# EAGLE design PTZ_23brd (EAGLE 6.4)
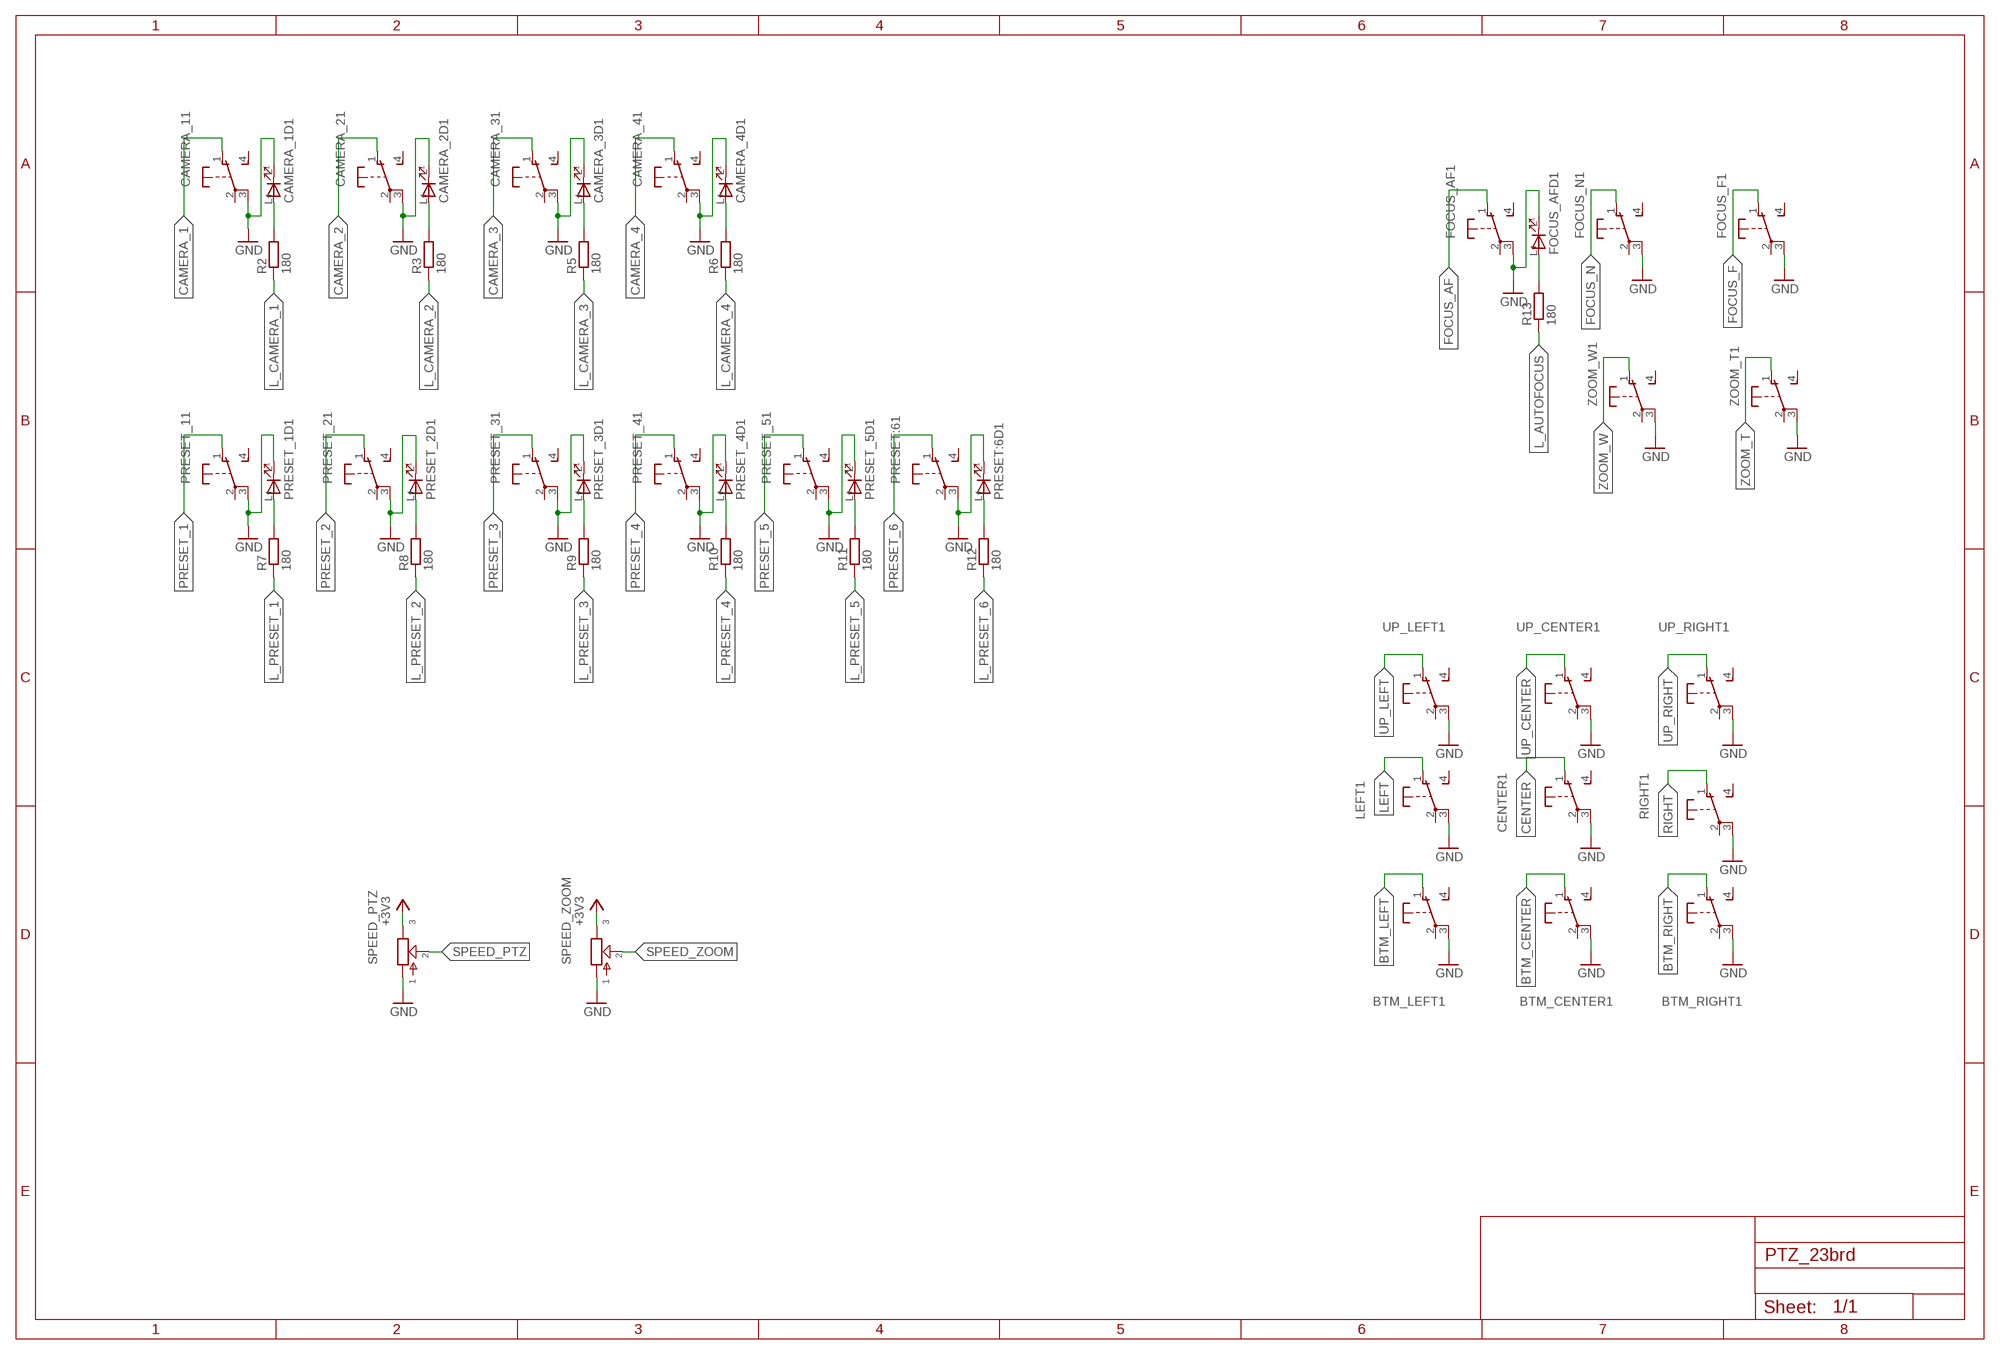
[diagram p0: schematic, sheet 1, part 1 of 2]
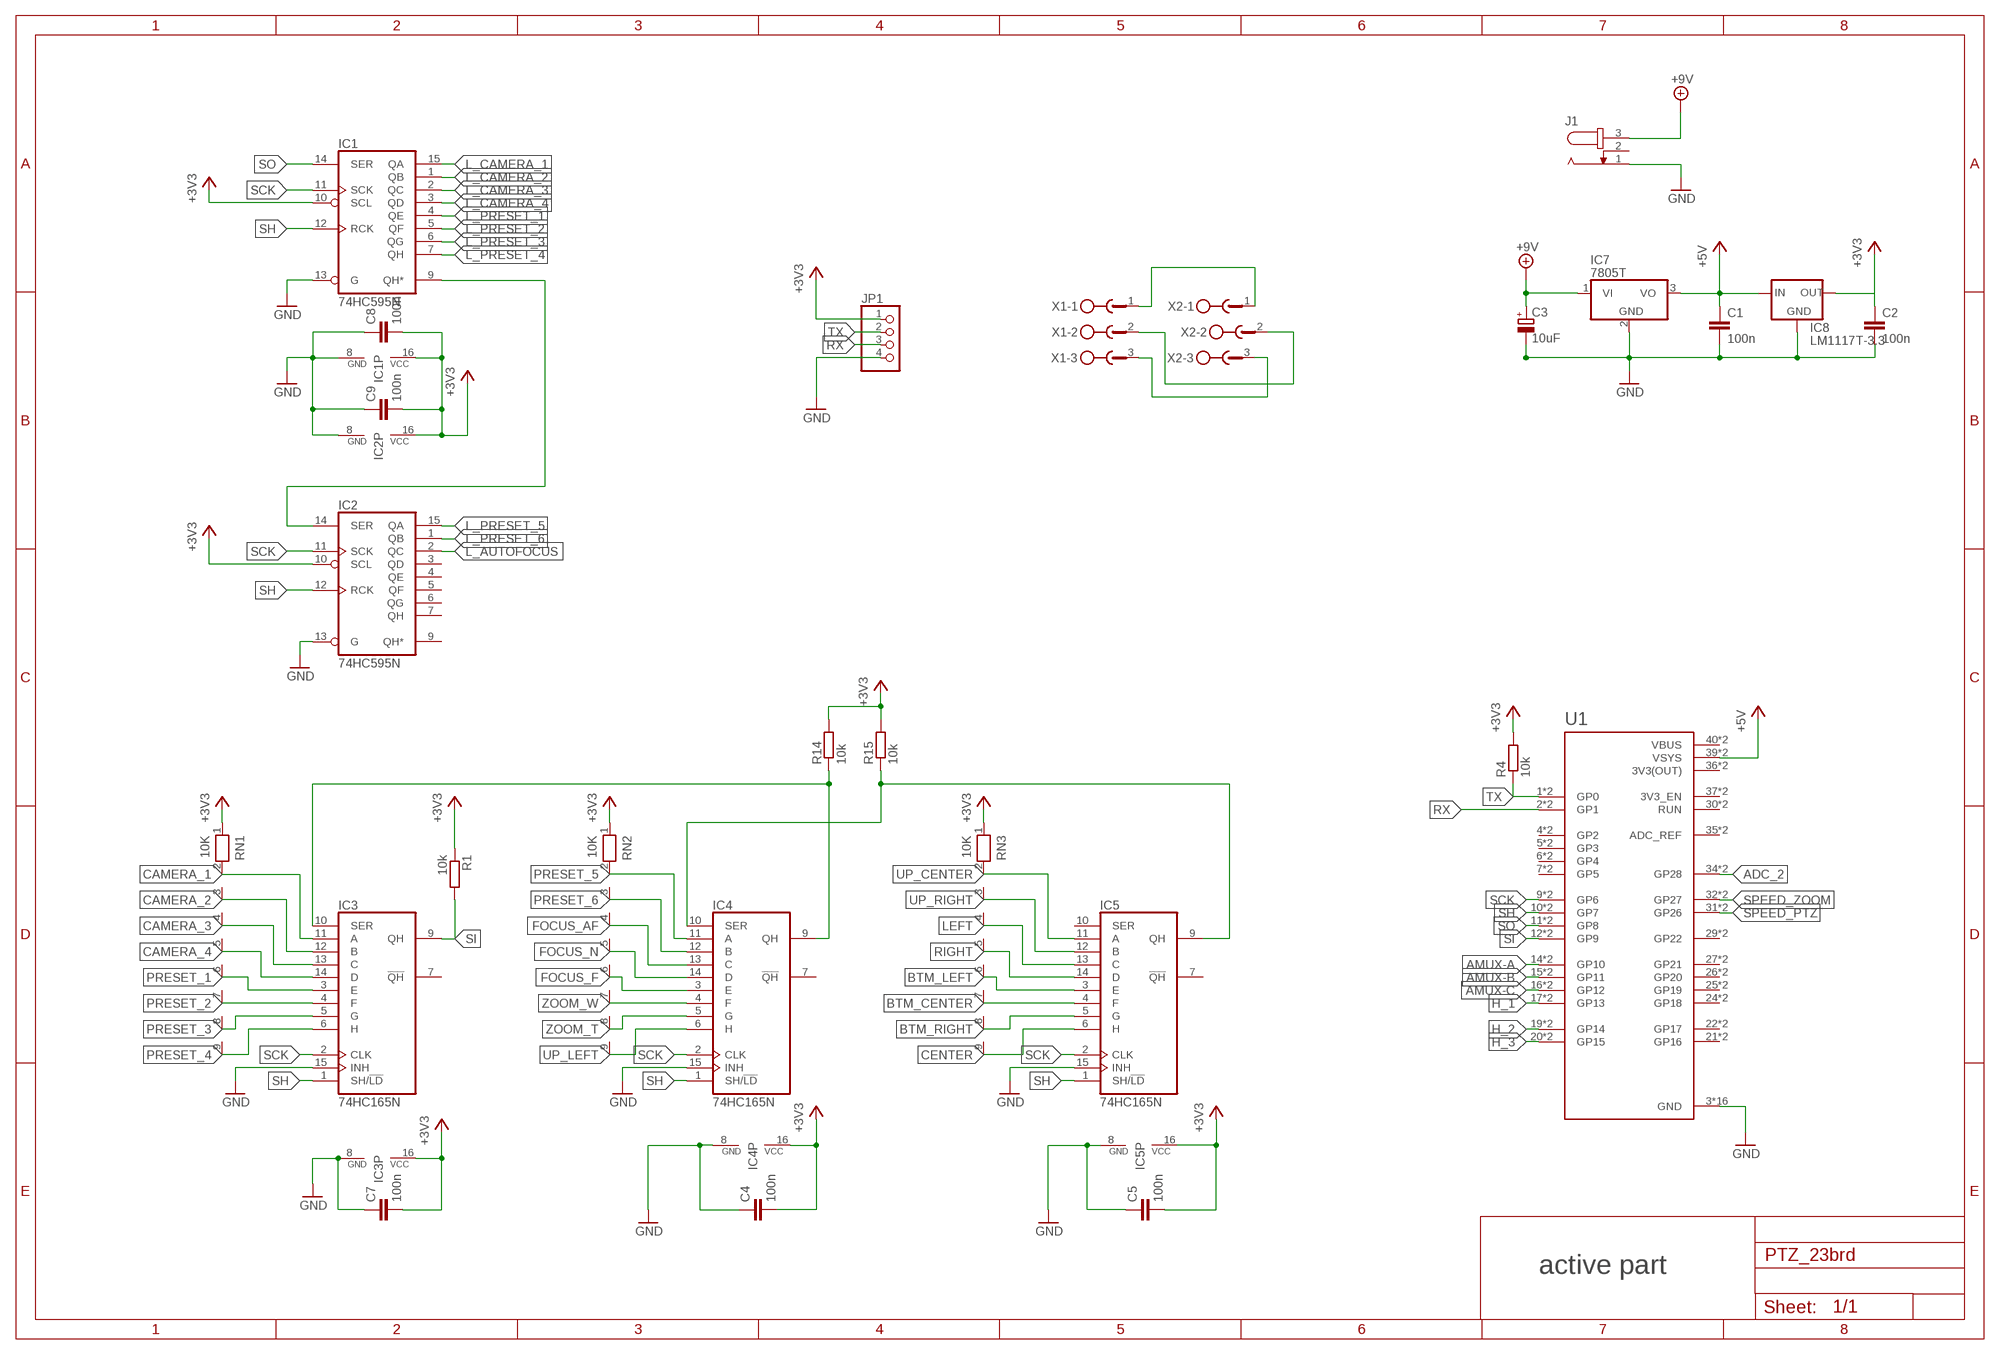
[diagram p1: schematic, sheet 1, part 2 of 2]

## Parts
BTM_CENTER  SWITCH-SHANPU_SRKLSHANPU_SPL  [SWITCH-SHANPU_SPLG1YCS0014]
BTM_LEFT  SWITCH-SHANPU_SRKLSHANPU_SPL  [SWITCH-SHANPU_SPLG1YCS0014]
BTM_RIGHT  SWITCH-SHANPU_SRKLSHANPU_SPL  [SWITCH-SHANPU_SPLG1YCS0014]
C1  100n  C-EU025-025X050  [C025-025X050]
C2  100n  C-EU025-025X050  [C025-025X050]
C3  10uF  CPOL-EUE2-5  [E2-5]
C4  100n  C-EU025-025X050  [C025-025X050]
C5  100n  C-EU025-025X050  [C025-025X050]
C7  100n  C-EU025-025X050  [C025-025X050]
C8  100n  C-EU025-025X050  [C025-025X050]
C9  100n  C-EU025-025X050  [C025-025X050]
CAMERA_1  SWITCH-SHANPU_SRKLSHANPU_SPL  [SWITCH-SHANPU_SPLG1YCS0014]
CAMERA_2  SWITCH-SHANPU_SRKLSHANPU_SPL  [SWITCH-SHANPU_SPLG1YCS0014]
CAMERA_3  SWITCH-SHANPU_SRKLSHANPU_SPL  [SWITCH-SHANPU_SPLG1YCS0014]
CAMERA_4  SWITCH-SHANPU_SRKLSHANPU_SPL  [SWITCH-SHANPU_SPLG1YCS0014]
CENTER  SWITCH-SHANPU_SRKLSHANPU_SPL  [SWITCH-SHANPU_SPLG1YCS0014]
FOCUS_AF  SWITCH-SHANPU_SRKLSHANPU_SPL  [SWITCH-SHANPU_SPLG1YCS0014]
FOCUS_F  SWITCH-SHANPU_SRKLSHANPU_SPL  [SWITCH-SHANPU_SPLG1YCS0014]
FOCUS_N  SWITCH-SHANPU_SRKLSHANPU_SPL  [SWITCH-SHANPU_SPLG1YCS0014]
IC1  74HC595N  [DIL16]
IC2  74HC595N  [DIL16]
IC3  74HC165N  [DIL16]
IC4  74HC165N  [DIL16]
IC5  74HC165N  [DIL16]
IC7  7805T  [TO220H]
IC8  LM1117T-3.3  LM1117_LM1117T-3.3  [LM1117_TO220]
J1  MOJO61_REAR42R_CON-JACK_JACK-PLUG  [MOJO61_REAR42R_CON-JACK_2.1PCB]
JP1  PINHD-1X4  [1X04]
LEFT  SWITCH-SHANPU_SRKLSHANPU_SPL  [SWITCH-SHANPU_SPLG1YCS0014]
PRESET:6  SWITCH-SHANPU_SRKLSHANPU_SPL  [SWITCH-SHANPU_SPLG1YCS0014]
PRESET_1  SWITCH-SHANPU_SRKLSHANPU_SPL  [SWITCH-SHANPU_SPLG1YCS0014]
PRESET_2  SWITCH-SHANPU_SRKLSHANPU_SPL  [SWITCH-SHANPU_SPLG1YCS0014]
PRESET_3  SWITCH-SHANPU_SRKLSHANPU_SPL  [SWITCH-SHANPU_SPLG1YCS0014]
PRESET_4  SWITCH-SHANPU_SRKLSHANPU_SPL  [SWITCH-SHANPU_SPLG1YCS0014]
PRESET_5  SWITCH-SHANPU_SRKLSHANPU_SPL  [SWITCH-SHANPU_SPLG1YCS0014]
R1  10k  R-EU_0207/7  [0207/7]
R2  180  R-EU_0207/7  [0207/7]
R3  180  R-EU_0207/7  [0207/7]
R4  10k  R-EU_0207/7  [0207/7]
R5  180  R-EU_0207/7  [0207/7]
R6  180  R-EU_0207/7  [0207/7]
R7  180  R-EU_0207/7  [0207/7]
R8  180  R-EU_0207/7  [0207/7]
R9  180  R-EU_0207/7  [0207/7]
R10  180  R-EU_0207/7  [0207/7]
R11  180  R-EU_0207/7  [0207/7]
R12  180  R-EU_0207/7  [0207/7]
R13  180  R-EU_0207/7  [0207/7]
R14  10k  R-EU_0207/7  [0207/7]
R15  10k  R-EU_0207/7  [0207/7]
RIGHT  SWITCH-SHANPU_SRKLSHANPU_SPL  [SWITCH-SHANPU_SPLG1YCS0014]
RN1  10K  RN08  [RN-9]
RN2  10K  RN08  [RN-9]
RN3  10K  RN08  [RN-9]
SPEED_PTZ  GM-POTS_POT-EU12MM  [GM-POTS_RV120DF-40B1-(L)K]
SPEED_ZOOM  GM-POTS_POT-EU12MM  [GM-POTS_RV120DF-40B1-(L)K]
U1  RPIPICO_RASPBERRY_PICO-NO_DEBUG  [RPIPICO_PICO-PKG-NO_DEBUG]
UP_CENTER  SWITCH-SHANPU_SRKLSHANPU_SPL  [SWITCH-SHANPU_SPLG1YCS0014]
UP_LEFT  SWITCH-SHANPU_SRKLSHANPU_SPL  [SWITCH-SHANPU_SPLG1YCS0014]
UP_RIGHT  SWITCH-SHANPU_SRKLSHANPU_SPL  [SWITCH-SHANPU_SPLG1YCS0014]
X1  W232-3  [W232-3]
X2  W232-3  [W232-3]
ZOOM_T  SWITCH-SHANPU_SRKLSHANPU_SPL  [SWITCH-SHANPU_SPLG1YCS0014]
ZOOM_W  SWITCH-SHANPU_SRKLSHANPU_SPL  [SWITCH-SHANPU_SPLG1YCS0014]

## Nets
+3V3: C2.1 C4.2 C5.2 C7.2 C8.2 C9.2 IC1.10(SCL) IC1.16(VCC) IC2.10(SCL) IC2.16(VCC) IC3.16(VCC) IC4.16(VCC) IC5.16(VCC) IC8.2(OUT) JP1.1 R1.1 R4.2 R14.2 R15.2 RN1.1 RN2.1 RN3.1 SPEED_PTZ.3 SPEED_ZOOM.3
+5V: C1.1 IC7.3(VO) IC8.3(IN) U1.39(VSYS) U1.P$39(VSYS)
+9V: C3.+ IC7.1(VI) J1.3
ADC_2: U1.34(GP28) U1.P$34(GP28)
AMUX-A: U1.14(GP10) U1.P$14(GP10)
AMUX-B: U1.15(GP11) U1.P$15(GP11)
AMUX-C: U1.16(GP12) U1.P$16(GP12)
BTM_CENTER: BTM_CENTER.1(1:O) IC5.4(F) RN3.7
BTM_LEFT: BTM_LEFT.1(1:O) IC5.3(E) RN3.6
BTM_RIGHT: BTM_RIGHT.1(1:O) IC5.5(G) RN3.8
CAMERA_1: CAMERA_1.1(1:O) IC3.11(A) RN1.2
CAMERA_2: CAMERA_2.1(1:O) IC3.12(B) RN1.3
CAMERA_3: CAMERA_3.1(1:O) IC3.13(C) RN1.4
CAMERA_4: CAMERA_4.1(1:O) IC3.14(D) RN1.5
CENTER: CENTER.1(1:O) IC5.6(H) RN3.9
FOCUS_AF: FOCUS_AF.1(1:O) IC4.13(C) RN2.4
FOCUS_F: FOCUS_F.1(1:O) IC4.3(E) RN2.6
FOCUS_N: FOCUS_N.1(1:O) IC4.14(D) RN2.5
GND: BTM_CENTER.3(1:P) BTM_LEFT.3(1:P) BTM_RIGHT.3(1:P) C1.2 C2.2 C3.- C4.1 C5.1 C7.1 C8.1 C9.1 CAMERA_1.3(1:P) CAMERA_1.L-(D1:C) CAMERA_2.3(1:P) CAMERA_2.L-(D1:C) CAMERA_3.3(1:P) CAMERA_3.L-(D1:C) CAMERA_4.3(1:P) CAMERA_4.L-(D1:C) CENTER.3(1:P) FOCUS_AF.3(1:P) FOCUS_AF.L-(D1:C) FOCUS_F.3(1:P) FOCUS_N.3(1:P) IC1.8(GND) IC1.13(G) IC2.8(GND) IC2.13(G) IC3.8(GND) IC3.15(INH) IC4.8(GND) IC4.15(INH) IC5.8(GND) IC5.15(INH) IC7.2(GND) IC8.1(GND) J1.1 JP1.4 LEFT.3(1:P) PRESET:6.3(1:P) PRESET:6.L-(D1:C) PRESET_1.3(1:P) PRESET_1.L-(D1:C) PRESET_2.3(1:P) PRESET_2.L-(D1:C) PRESET_3.3(1:P) PRESET_3.L-(D1:C) PRESET_4.3(1:P) PRESET_4.L-(D1:C) PRESET_5.3(1:P) PRESET_5.L-(D1:C) RIGHT.3(1:P) SPEED_PTZ.1 SPEED_ZOOM.1 U1.3(GND) U1.8(GND) U1.13(GND) U1.18(GND) U1.23(GND) U1.28(GND) U1.33(GND) U1.38(GND) U1.P$3(GND) U1.P$8(GND) U1.P$13(GND) U1.P$18(GND) U1.P$23(GND) U1.P$28(GND) U1.P$33(GND) U1.P$38(GND) UP_CENTER.3(1:P) UP_LEFT.3(1:P) UP_RIGHT.3(1:P) ZOOM_T.3(1:P) ZOOM_W.3(1:P)
H_1: U1.17(GP13) U1.P$17(GP13)
H_2: U1.19(GP14) U1.P$19(GP14)
H_3: U1.20(GP15) U1.P$20(GP15)
L_AUTOFOCUS: IC2.2(QC) R13.1
L_CAMERA_1: IC1.15(QA) R2.1
L_CAMERA_2: IC1.1(QB) R3.1
L_CAMERA_3: IC1.2(QC) R5.1
L_CAMERA_4: IC1.3(QD) R6.1
L_PRESET_1: IC1.4(QE) R7.1
L_PRESET_2: IC1.5(QF) R8.1
L_PRESET_3: IC1.6(QG) R9.1
L_PRESET_4: IC1.7(QH) R10.1
L_PRESET_5: IC2.15(QA) R11.1
L_PRESET_6: IC2.1(QB) R12.1
LEFT: IC5.13(C) LEFT.1(1:O) RN3.4
N$1: IC1.9(QH*) IC2.14(SER)
N$2: IC3.10(SER) IC4.9(QH) R14.1
N$3: CAMERA_1.L+(D1:A) R2.2
N$4: IC4.10(SER) IC5.9(QH) R15.1
N$5: PRESET_2.L+(D1:A) R8.2
N$6: X1.1 X2.1
N$7: X1.2 X2.2
N$8: X1.3 X2.3
N$11: CAMERA_2.L+(D1:A) R3.2
N$12: CAMERA_3.L+(D1:A) R5.2
N$13: PRESET_3.L+(D1:A) R9.2
N$14: CAMERA_4.L+(D1:A) R6.2
N$17: FOCUS_AF.L+(D1:A) R13.2
N$21: PRESET_4.L+(D1:A) R10.2
N$22: PRESET_1.L+(D1:A) R7.2
N$25: PRESET_5.L+(D1:A) R11.2
N$28: PRESET:6.L+(D1:A) R12.2
PRESET_1: IC3.3(E) PRESET_1.1(1:O) RN1.6
PRESET_2: IC3.4(F) PRESET_2.1(1:O) RN1.7
PRESET_3: IC3.5(G) PRESET_3.1(1:O) RN1.8
PRESET_4: IC3.6(H) PRESET_4.1(1:O) RN1.9
PRESET_5: IC4.11(A) PRESET_5.1(1:O) RN2.2
PRESET_6: IC4.12(B) PRESET:6.1(1:O) RN2.3
RIGHT: IC5.14(D) RIGHT.1(1:O) RN3.5
RX: JP1.3 U1.2(GP1) U1.P$2(GP1)
SCK: IC1.11(SCK) IC2.11(SCK) IC3.2(CLK) IC4.2(CLK) IC5.2(CLK) U1.9(GP6) U1.P$9(GP6)
SH: IC1.12(RCK) IC2.12(RCK) IC3.1(SH/!LD) IC4.1(SH/!LD) IC5.1(SH/!LD) U1.10(GP7) U1.P$10(GP7)
SI: IC3.9(QH) R1.2 U1.12(GP9) U1.P$12(GP9)
SO: IC1.14(SER) U1.11(GP8) U1.P$11(GP8)
SPEED_PTZ: SPEED_PTZ.2 U1.31(GP26) U1.P$31(GP26)
SPEED_ZOOM: SPEED_ZOOM.2 U1.32(GP27) U1.P$32(GP27)
TX: JP1.2 R4.1 U1.1(GP0) U1.P$1(GP0)
UP_CENTER: IC5.11(A) RN3.2 UP_CENTER.1(1:O)
UP_LEFT: IC4.6(H) RN2.9 UP_LEFT.1(1:O)
UP_RIGHT: IC5.12(B) RN3.3 UP_RIGHT.1(1:O)
ZOOM_T: IC4.5(G) RN2.8 ZOOM_T.1(1:O)
ZOOM_W: IC4.4(F) RN2.7 ZOOM_W.1(1:O)
Unconnected: BTM_CENTER.2(1:P) BTM_CENTER.4(1:S) BTM_CENTER.L+(D1:A) BTM_CENTER.L-(D1:C) BTM_LEFT.2(1:P) BTM_LEFT.4(1:S) BTM_LEFT.L+(D1:A) BTM_LEFT.L-(D1:C) BTM_RIGHT.2(1:P) BTM_RIGHT.4(1:S) BTM_RIGHT.L+(D1:A) BTM_RIGHT.L-(D1:C) CAMERA_1.2(1:P) CAMERA_1.4(1:S) CAMERA_2.2(1:P) CAMERA_2.4(1:S) CAMERA_3.2(1:P) CAMERA_3.4(1:S) CAMERA_4.2(1:P) CAMERA_4.4(1:S) CENTER.2(1:P) CENTER.4(1:S) CENTER.L+(D1:A) CENTER.L-(D1:C) FOCUS_AF.2(1:P) FOCUS_AF.4(1:S) FOCUS_F.2(1:P) FOCUS_F.4(1:S) FOCUS_F.L+(D1:A) FOCUS_F.L-(D1:C) FOCUS_N.2(1:P) FOCUS_N.4(1:S) FOCUS_N.L+(D1:A) FOCUS_N.L-(D1:C) IC2.3(QD) IC2.4(QE) IC2.5(QF) IC2.6(QG) IC2.7(QH) IC2.9(QH*) IC3.7(!QH) IC4.7(!QH) IC5.7(!QH) IC5.10(SER) J1.2 LEFT.2(1:P) LEFT.4(1:S) LEFT.L+(D1:A) LEFT.L-(D1:C) PRESET:6.2(1:P) PRESET:6.4(1:S) PRESET_1.2(1:P) PRESET_1.4(1:S) PRESET_2.2(1:P) PRESET_2.4(1:S) PRESET_3.2(1:P) PRESET_3.4(1:S) PRESET_4.2(1:P) PRESET_4.4(1:S) PRESET_5.2(1:P) PRESET_5.4(1:S) RIGHT.2(1:P) RIGHT.4(1:S) RIGHT.L+(D1:A) RIGHT.L-(D1:C) U1.4(GP2) U1.5(GP3) U1.6(GP4) U1.7(GP5) U1.21(GP16) U1.22(GP17) U1.24(GP18) U1.25(GP19) U1.26(GP20) U1.27(GP21) U1.29(GP22) U1.30(RUN) U1.35(ADC_REF) U1.37(3V3_EN) U1.P$4(GP2) U1.P$5(GP3) U1.P$6(GP4) U1.P$7(GP5) U1.P$21(GP16) U1.P$22(GP17) U1.P$24(GP18) U1.P$25(GP19) U1.P$26(GP20) U1.P$27(GP21) U1.P$29(GP22) U1.P$30(RUN) U1.P$35(ADC_REF) U1.P$37(3V3_EN) UP_CENTER.2(1:P) UP_CENTER.4(1:S) UP_CENTER.L+(D1:A) UP_CENTER.L-(D1:C) UP_LEFT.2(1:P) UP_LEFT.4(1:S) UP_LEFT.L+(D1:A) UP_LEFT.L-(D1:C) UP_RIGHT.2(1:P) UP_RIGHT.4(1:S) UP_RIGHT.L+(D1:A) UP_RIGHT.L-(D1:C) ZOOM_T.2(1:P) ZOOM_T.4(1:S) ZOOM_T.L+(D1:A) ZOOM_T.L-(D1:C) ZOOM_W.2(1:P) ZOOM_W.4(1:S) ZOOM_W.L+(D1:A) ZOOM_W.L-(D1:C)

## Notes on the sheet
- active part

## Power pins joined to a net without a drawn wire
3V3(OUT): U1.36(3V3(OUT)) U1.P$36(3V3(OUT))
VBUS: U1.40(VBUS) U1.P$40(VBUS)

## Library data of the parts
BTM_CENTER BTM_LEFT BTM_RIGHT CAMERA_1-CAMERA_4 CENTER FOCUS_AF FOCUS_F FOCUS_N LEFT PRESET:6 PRESET_1-PRESET_5 RIGHT UP_CENTER UP_LEFT UP_RIGHT ZOOM_T ZOOM_W = MOJO_CL_SC_RIGHT_V28:SWITCH-SHANPU_SRKL: SWITCH
C1 C2 C4 C5 C7-C9 = rcl:C-EU: CAPACITOR, European symbol
C3 = rcl:CPOL-EU: POLARIZED CAPACITOR, European symbol
IC1 IC2 = 74xx-eu:74*595: 8-bit SHIFT REGISTER, output latch
IC3-IC5 = 74xx-eu:74*165: 8-bit parallel load SHIFT REGISTER
IC7 = linear:78*: Positive VOLTAGE REGULATOR Source: http://cache.national.com/ds/LM/LM78L05.pdf http://www.fairchildsemi.com/ds/LM/LM7805.pdf
IC8 = mojo61_100_left_PICO:LM1117_LM1117T-*
J1 = gemini_rear_2021_15:MOJO61_REAR42R_CON-JACK_JACK-PLUG: DC POWER JACK Power Jack, DC, Right Angle, Through Hole, Rated 5A at 16VDC, PC Terminals Distributor: Farnell (www.Farnell.de) Drawing: 84N1161.pdf / 84N1162.pdf Manufacturer: SPC Technology (www.spctechnology.com) Type: SPC4077 / SPC 4078
JP1 = pinhead:PINHD-1X4: PIN HEADER
R1-R15 = rcl:R-EU_: RESISTOR, European symbol
RN1-RN3 = resistor-net:RN08: RESISTOR NETWORK; OC_FARNELL: unknown; OC_NEWARK: unknown
SPEED_PTZ SPEED_ZOOM = MOJO_CL_SC_RIGHT_V28:GM-POTS_POT-EU
U1 = mojo61_100_left_PICO:RPIPICO_RASPBERRY_PICO-NO_DEBUG
X1 X2 = con-wago-508:W232-3: WAGO SREW CLAMP; OC_FARNELL: unknown; OC_NEWARK: unknown

## Board
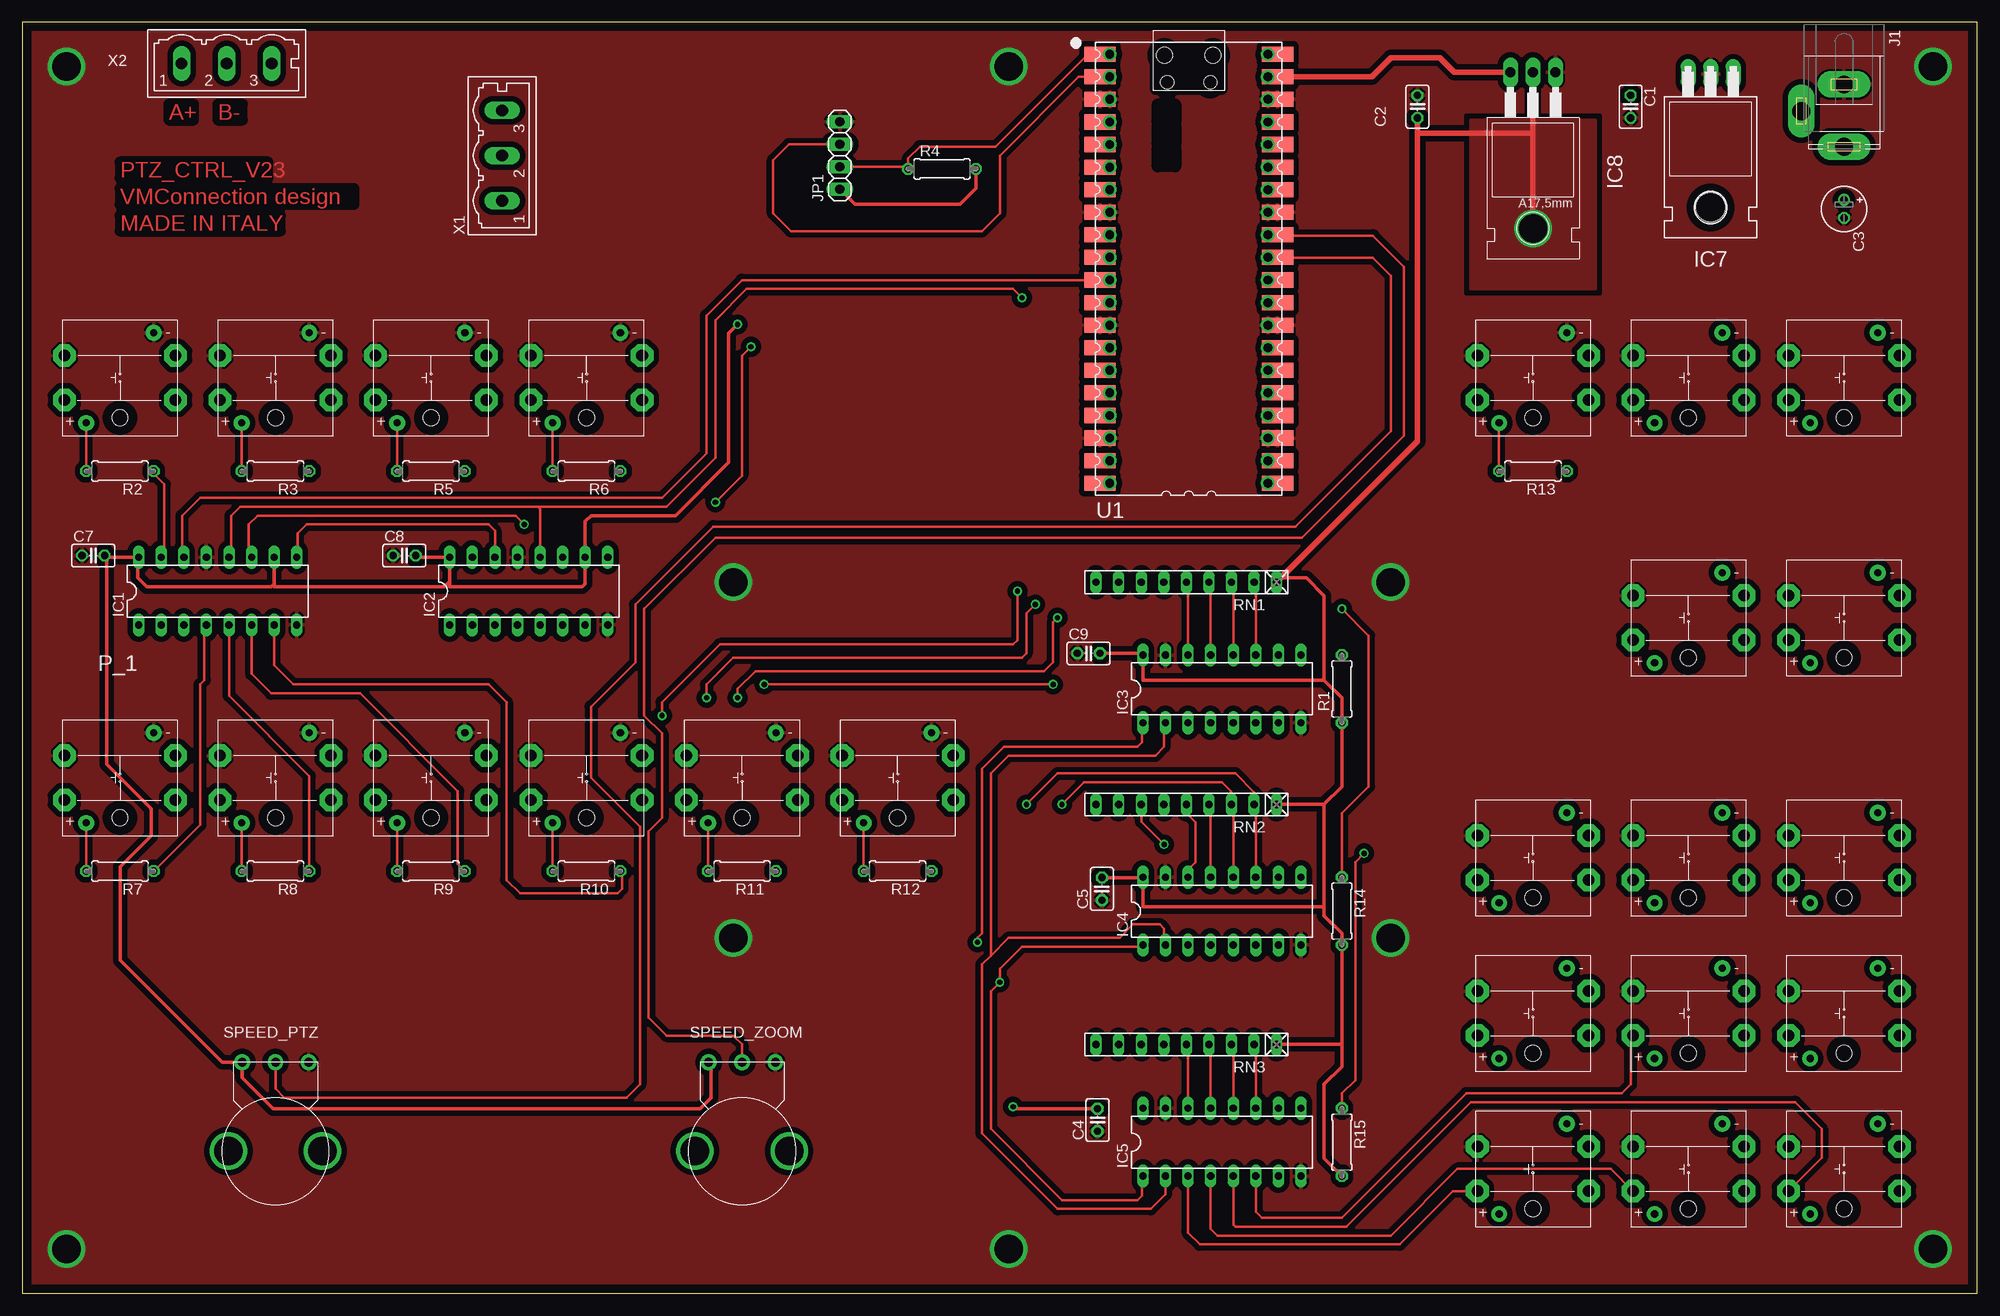
[diagram p2: board, top side]
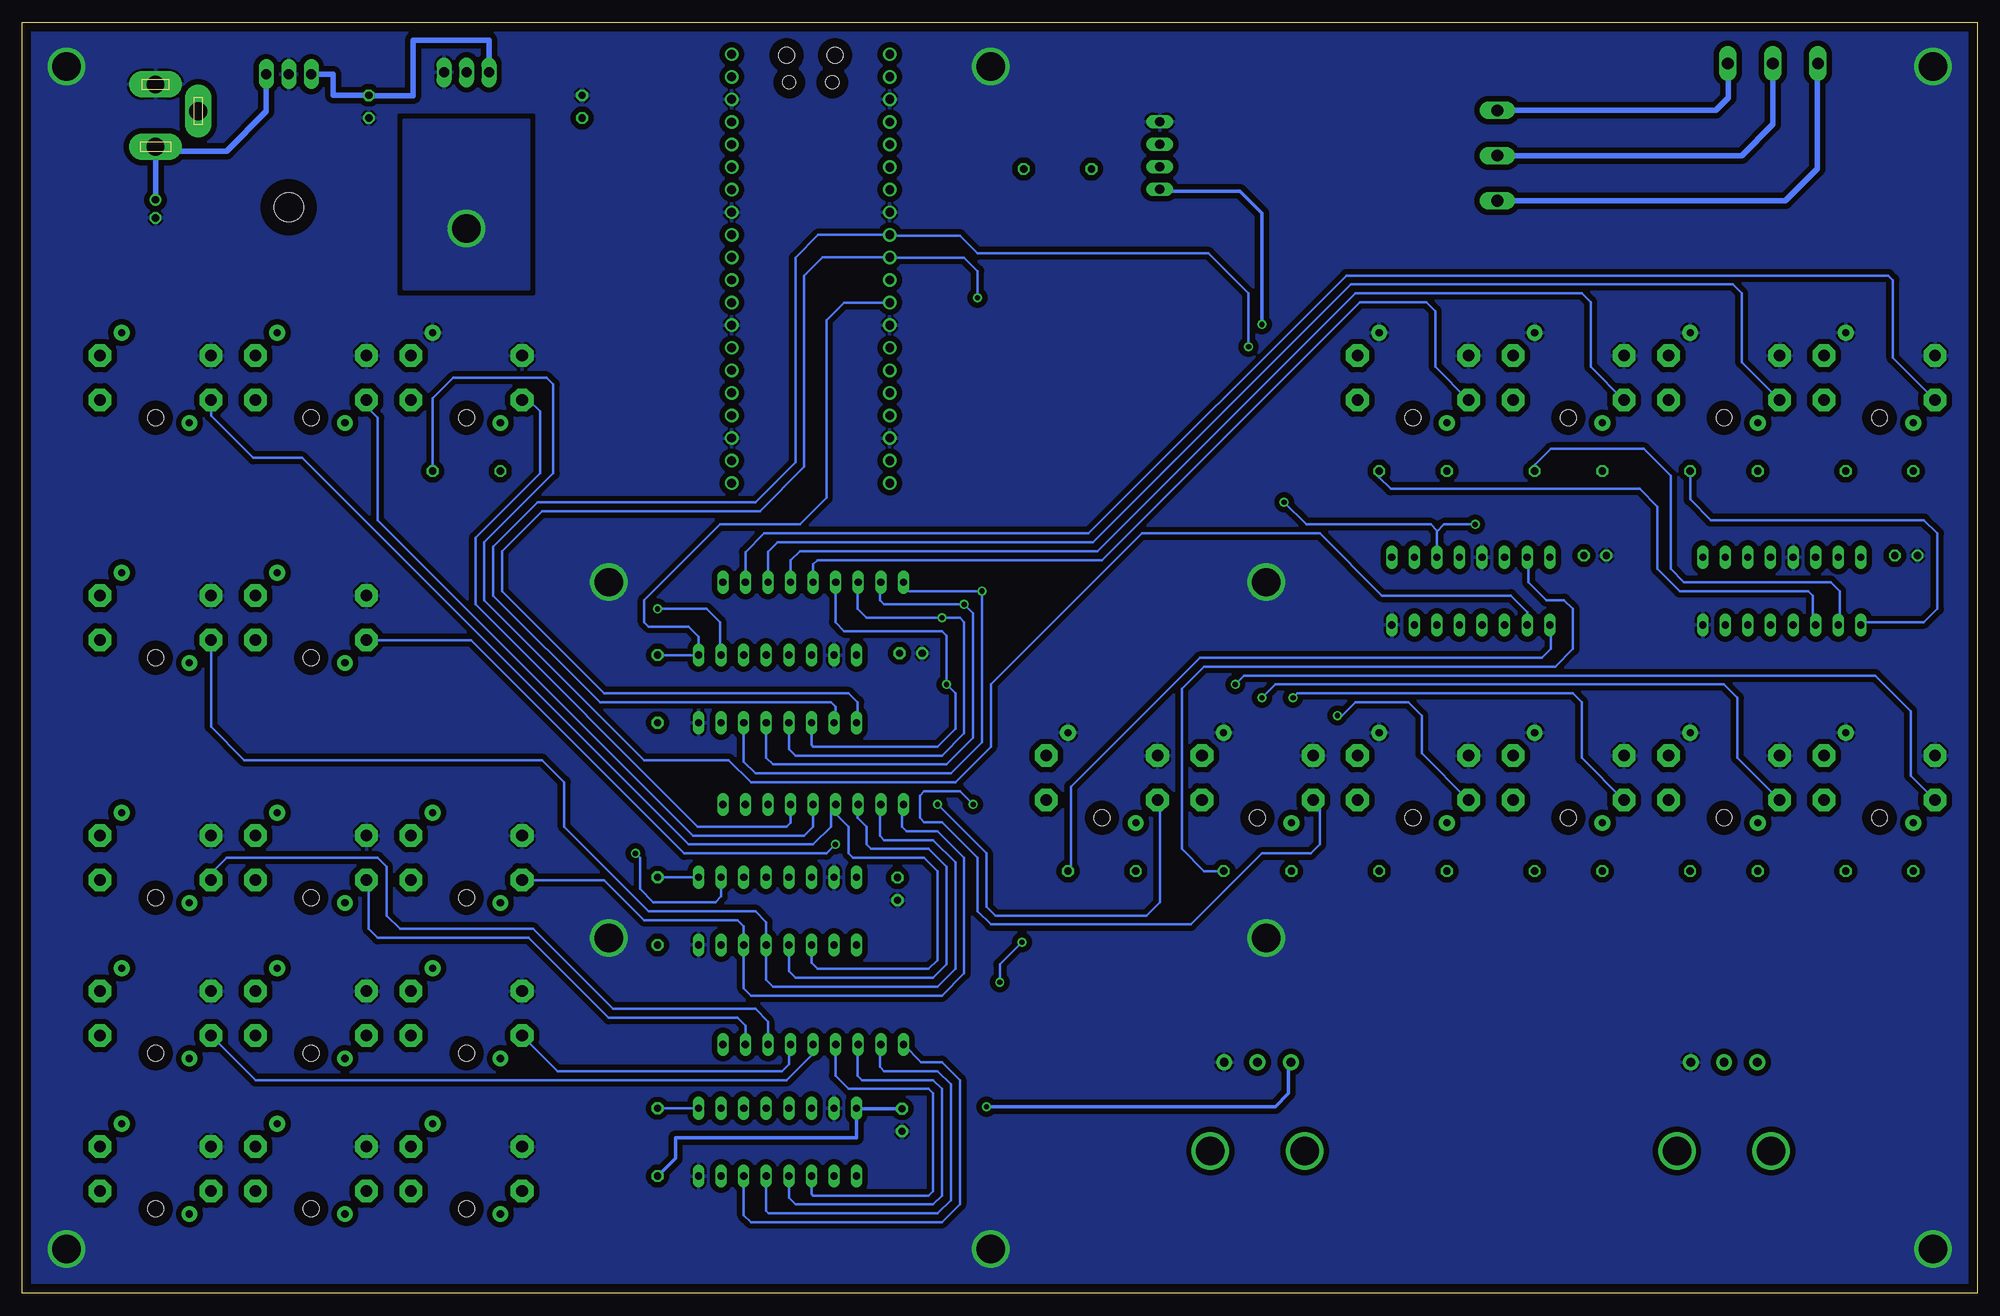
[diagram p3: board, bottom side, seen from below]

Size 220 x 143 mm. Coordinates in mm from the lower left corner, seen from the top.
Outline: 0,0 220,0 220,143 0,143 0,0
Copper layers (1*16): Top 0.035mm / dielectric 1.5mm / Bottom 0.035mm
Design rules "default": minimum track width 10mil, minimum drill 24mil, track to track 8mil, track to pad 8mil, pad to pad 8mil, via to via 8mil, smd to smd 8mil, copper to edge 40mil, drill to drill 8mil, minimum pad ring 10mil, minimum via ring 8mil, stop-mask expansion 4mil, vias tented up to drill 0mil, thermal gap 10mil

### Footprints (pad centres in the part's own frame; a part is rotated, then mirrored left to right if it is on the bottom)
SWITCH-SHANPU_SPLG1YCS0014 = drill 1.3 pad 2.54 octagon: 1 -6.25,-2.5; 2 6.25,-2.5; 3 -6.25,2.5; 4 6.25,2.5 | drill 0.8 pad 1.778: L+ -3.81,-5.08; L- 3.81,5.08 | hole 1.8: 0,-4.5
C025-025X050 = drill 0.813 octagon: 1 -1.27,0; 2 1.27,0
E2-5 = drill 0.813 pad 1.27: + -1.016,0 | drill 0.813 pad 1.27 octagon: - 1.016,0
DIL16 = drill 0.813 long: 1 -8.89,-3.81; 2 -6.35,-3.81; 3 -3.81,-3.81; 4 -1.27,-3.81; 5 1.27,-3.81; 6 3.81,-3.81; 7 6.35,-3.81; 8 8.89,-3.81; 9 8.89,3.81; 10 6.35,3.81; 11 3.81,3.81; 12 1.27,3.81; 13 -1.27,3.81; 14 -3.81,3.81; 15 -6.35,3.81; 16 -8.89,3.81
TO220H = drill 1.118 long: 1 -2.54,-10.16; 2 0,-10.16; 3 2.54,-10.16 | hole 3.302: 0,4.826
LM1117_TO220 = drill 1.118 long: 1 -2.54,-6.35; 2 0,-6.35; 3 2.54,-6.35
MOJO61_REAR42R_CON-JACK_2.1PCB = drill 2 pad 2.54 long: 1 -4,0; 2 -1,-4.8 | drill 2 pad 3 long: 3 3,0
1X04 = drill 1.016 long: 1 -3.81,0; 2 -1.27,0; 3 1.27,0; 4 3.81,0
0207/7 = drill 0.813 octagon: 1 -3.81,0; 2 3.81,0
RN-9 = drill 0.813 long: 1 -10.16,0; 2 -7.62,0; 3 -5.08,0; 4 -2.54,0; 5 0,0; 6 2.54,0; 7 5.08,0; 8 7.62,0; 9 10.16,0
GM-POTS_RV120DF-40B1-(L)K = drill 1 pad 1.778: 1 -3.75,-10; 2 0,-10; 3 3.75,-10 | drill 3.2: P$4 -5.3,0; P$5 5.3,0
RPIPICO_PICO-PKG-NO_DEBUG = drill 1: 1 -7.62,25.4; 2 -7.62,22.86; 3 -7.62,20.32; 4 -7.62,17.78; 5 -7.62,15.24; 6 -7.62,12.7; 7 -7.62,10.16; 8 -7.62,7.62; 9 -7.62,5.08; 10 -7.62,2.54; 11 -7.62,0; 12 -7.62,-2.54; 13 -7.62,-5.08; 14 -7.62,-7.62; 15 -7.62,-10.16; 16 -7.62,-12.7; 17 -7.62,-15.24; 18 -7.62,-17.78; 19 -7.62,-20.32; 20 -7.62,-22.86; 21 10.16,-22.86; 22 10.16,-20.32; 23 10.16,-17.78; 24 10.16,-15.24; 25 10.16,-12.7; 26 10.16,-10.16; 27 10.16,-7.62; 28 10.16,-5.08; 29 10.16,-2.54; 30 10.16,0; 31 10.16,2.54; 32 10.16,5.08; 33 10.16,7.62; 34 10.16,10.16; 35 10.16,12.7; 36 10.16,15.24; 37 10.16,17.78; 38 10.16,20.32; 39 10.16,22.86; 40 10.16,25.4 | smd 3.5 x 1.7: P$1 -8.73,25.4; P$2 -8.73,22.86; P$3 -8.73,20.32; P$4 -8.73,17.78; P$5 -8.73,15.24; P$6 -8.73,12.7; P$7 -8.73,10.16; P$8 -8.73,7.62; P$9 -8.73,5.08; P$10 -8.73,2.54; P$11 -8.73,0; P$12 -8.73,-2.54; P$13 -8.73,-5.08; P$14 -8.73,-7.62; P$15 -8.73,-10.16; P$16 -8.73,-12.7; P$17 -8.73,-15.24; P$18 -8.73,-17.78; P$19 -8.73,-20.32; P$20 -8.73,-22.86; P$21 11.27,-22.86; P$22 11.27,-20.32; P$23 11.27,-17.78; P$24 11.27,-15.24; P$25 11.27,-12.7; P$26 11.27,-10.16; P$27 11.27,-7.62; P$28 11.27,-5.08; P$29 11.27,-2.54; P$30 11.27,0; P$31 11.27,2.54; P$32 11.27,5.08; P$33 11.27,7.62; P$34 11.27,10.16; P$35 11.27,12.7; P$36 11.27,15.24; P$37 11.27,17.78; P$38 11.27,20.32; P$39 11.27,22.86; P$40 11.27,25.4 | hole 1.8: -1.455,25.27; 3.995,25.27 | hole 1.5: -1.155,22.24; 3.695,22.24
W232-3 = drill 1.321 long: 1 -5.08,-0.635; 2 0,-0.635; 3 5.08,-0.635

### Placement (x,y rotation side)
BTM_CENTER  187.5,14 0 top
BTM_LEFT  170,14 0 top
BTM_RIGHT  205,14 0 top
C1  181,133.5 270 top
C2  157,133.5 90 top
C3  205,122 270 top
C4  121,19.5 90 top
C5  121.5,45.5 90 top
C7  8,83 0 top
C8  43,83 0 top
C9  120,72 0 top
CAMERA_1  11,103 0 top
CAMERA_2  28.5,103 0 top
CAMERA_3  46,103 0 top
CAMERA_4  63.5,103 0 top
CENTER  187.5,31.5 0 top
FOCUS_AF  170,103 0 top
FOCUS_F  205,103 0 top
FOCUS_N  187.5,103 0 top
IC1  22,79 0 top
IC2  57,79 0 top
IC3  135,68 0 top
IC4  135,43 0 top
IC5  135,17 0 top
IC7  190,127 180 top
IC8  170,131 180 top
J1  205,132 270 top
JP1  92,128 90 top
LEFT  170,31.5 0 top
PRESET:6  98.5,58 0 top
PRESET_1  11,58 0 top
PRESET_2  28.5,58 0 top
PRESET_3  46,58 0 top
PRESET_4  63.5,58 0 top
PRESET_5  81,58 0 top
R1  148.5,68 90 top
R2  11,92.5 180 top
R3  28.5,92.5 180 top
R4  103.5,126.5 0 top
R5  46,92.5 180 top
R6  63.5,92.5 180 top
R7  11,47.5 180 top
R8  28.5,47.5 180 top
R9  46,47.5 180 top
R10  63.5,47.5 180 top
R11  81,47.5 180 top
R12  98.5,47.5 180 top
R13  170,92.5 180 top
R14  148.5,43 270 top
R15  148.5,17 270 top
RIGHT  205,31.5 0 top
RN1  131,80 180 top
RN2  131,55 180 top
RN3  131,28 180 top
SPEED_PTZ  28.5,16 180 top
SPEED_ZOOM  81,16 180 top
U1  130,114 0 top
UP_CENTER  187.5,49 0 top
UP_LEFT  170,49 0 top
UP_RIGHT  205,49 0 top
X1  53.37,128 90 top
X2  23,139 0 top
ZOOM_T  205,76 0 top
ZOOM_W  187.5,76 0 top

### Tracks (layer width: path | path; a pad name or v marks a point on that pad's centre or on a via)
3V3(OUT)
  Top 0.406: U1.P$36 U1.36
+3V3  (via drill 0.6, 3.2)
  Top 0.406: C7.2 9.5,82.77 | C8.2 44.46,82.81 IC2.16 | C9.2 125.92,72 IC3.16 126.11,69 146.5,69 | C5.2 126.07,46.77 IC4.16 126.11,43.5 146.5,43.5 | JP1.1 93.69,122.5 105.5,122.5 107.31,124.31 R4.2 | IC2.16 48.11,80.11 47.5,79.5 28.35,79.5 IC1.10 28.35,79.85 28,79.5 14,79.5 13,80.5 13,82.7 IC1.16 9.54,82.81 9.5,82.77 | IC2.16 48.11,79.5 63,79.5 63.35,79.85 IC2.10 63.35,86.85 64,87.5 73.5,87.5 79.5,93.5 79.5,108 v80.5,109 | 146.5,55 RN2.1 | R1.1 148.5,64 | RN1.1 141.66,80.5 144.5,80.5 146.5,78.5 146.5,69 | 148.5,28 R14.2 148.5,40.5 146.5,42.5 146.5,43.5 | 148.5,28 RN3.1 | R15.2 146.5,15.19 146.5,23.5 148.5,25.5 148.5,28 | SPEED_ZOOM.3 77.5,25.75 77.5,22 76.27,20.77 28.23,20.77 24.75,24.25 SPEED_PTZ.3 22.5,26 11,37.5 11,48 14.5,51.5 14.5,54.5 9.5,59.5 9.5,82.77 | 146.5,43.5 146.5,55 | R1.1 148.5,57 146.5,55 | R1.1 148.5,67 146.5,69 | C4.2 111.73,20.77 v111.5,21
  Top 0.61: 170,120 IC8.2 170,130.5 157,130.5 C2.1 157,95.84 RN1.1
  Bottom 0.406: v80.5,109 80.5,121.5 83,124 91.81,124 JP1.1 | C4.2 126.11,20.77 IC5.16 126.11,17.5 146.5,17.5 146.5,15.19 R15.2 | v111.5,21 79,21 77.5,22.5 77.5,25.75 SPEED_ZOOM.3
  other vias: 170,119.8
  pour Top (isolate 0.61): 177,132 163,132 163,113 177,113
  pour Bottom (isolate 0.61): 177,132 163,132 163,113 177,113
+5V
  Top 0.406: U1.P$39 U1.39
  Top 0.61: IC8.3 161.15,137.35 159.5,139 154,139 151.86,136.86 U1.P$39
  Bottom 0.61: IC7.3 185,137.16 185,134.77 C1.1 181,134.73 176,134.73 176,141 167.46,141 IC8.3
+9V
  Bottom 0.61: C3.+ J1.3 204.5,128.5 197,128.5 192.54,132.96 IC7.1
ADC_2
  Top 0.254: U1.34 U1.P$34
AMUX-A
  Top 0.406: U1.14 U1.P$14
AMUX-B
  Top 0.406: U1.15 U1.P$15
AMUX-C
  Top 0.406: U1.16 U1.P$16
BTM_CENTER
  Top 0.254: BTM_CENTER.1 178.75,14 161.5,14 154,6.5 134.5,6.5 133.73,7.27 IC5.4
  Bottom 0.254: RN3.7 126,27.92 126,24.5 125.5,24 117.5,24 116.5,23 116.5,11 117.5,10 133,10 133.73,10.73 IC5.4
BTM_LEFT
  Top 0.254: BTM_LEFT.1 161,11.5 155,5.5 132.5,5.5 131.19,6.81 IC5.3
  Bottom 0.254: RN3.6 128.5,28 128.5,24.5 127,23 118,23 117.5,22.5 117.5,11.5 118,11 131,11 131.19,11.19 IC5.3
BTM_RIGHT
  Top 0.254: IC5.5 136.27,7.73 136.5,7.5 149,7.5 163,21.5 199.5,21.5 202.5,18.5 202.5,15.25 BTM_RIGHT.1
  Bottom 0.254: RN3.8 123.5,27.88 123.5,25.5 123,25 117,25 115.5,23.5 115.5,10.5 117,9 136,9 136.27,9.27 IC5.5
CAMERA_1
  Top 0.254: IC3.11 138.81,79.81 RN1.2
  Bottom 0.254: CAMERA_1.1 9.5,105.25 9.5,114 10,114.5 71,114.5 100,85.5 136.5,85.5 138.62,83.38 RN1.2
CAMERA_2
  Top 0.254: IC3.12 136.27,79.81 RN1.3
  Bottom 0.254: CAMERA_2.1 26.5,104.75 26.5,112.5 27.5,113.5 70.5,113.5 99.5,84.5 135,84.5 136.08,83.42 RN1.3
CAMERA_3
  Top 0.254: IC3.13 133.73,79.81 RN1.4
  Bottom 0.254: CAMERA_3.1 43.5,104.25 43.5,111.5 44.5,112.5 70,112.5 99,83.5 132.5,83.5 133.54,82.46 RN1.4
CAMERA_4
  Top 0.254: IC3.14 131.19,79.81 RN1.5
  Bottom 0.254: CAMERA_4.1 61,104.25 61,110.5 62,111.5 69.5,111.5 98.5,82.5 130.5,82.5 131,82 RN1.5
CENTER
  Top 0.254: IC5.6 138.81,9.19 139.5,8.5 148.5,8.5 162.5,22.5 180,22.5 181,23.5 181,28.75 CENTER.1
  Bottom 0.254: RN3.9 118.84,26 116.5,26 114.5,24 114.5,10 116.5,8 138,8 138.81,8.81 IC5.6
FOCUS_AF
  Top 0.254: IC4.13 133.73,54.81 RN2.4
  Bottom 0.254: RN2.4 133.54,52.96 134,52.5 144,52.5 169,77.5 169,85 161.75,92.25 161.75,99.25 163,100.5 FOCUS_AF.1
FOCUS_F
  Bottom 0.254: RN2.6 128.5,54.96 | IC4.3 131.19,37.19 130.5,36.5 118,36.5 117,37.5 117,47.5 118.5,49 126.5,49 127,49.5 127,52.5 128.46,53.96 RN2.6 | RN2.6 128.5,55 128.5,54.96 | FOCUS_F.1 198.75,98.75 194,94 188.5,94 145,50.5 131,50.5 129,52.5 129,54.46 128.5,54.96
FOCUS_N
  Top 0.254: 131.19,54.81 RN2.5 131,54 132,53 132,48.5 131.5,48 131.5,47.12 IC4.14
  Bottom 0.254: RN2.5 131,52.5 132,51.5 144.5,51.5 180,87 180,98.5 181.25,99.75 FOCUS_N.1
GND  (via drill 3.2)
  other vias: 5,5 215,5 5,138 215,138 111,138 80,80 80,40 154,40 154,80 111,5
  pour Top (isolate 0.61, rank 2): -5,-7 225,-7 225,143 -5,143
  pour Bottom (isolate 0.61, rank 2): -5,-7 225,-7 225,143 -5,143
H_1
  Top 0.406: U1.17 U1.P$17
H_2
  Top 0.406: U1.19 U1.P$19
H_3
  Top 0.406: U1.20 U1.P$20
L_AUTOFOCUS
  Bottom 0.254: 50.5,75.04 IC2.2 50.65,76.65 52.5,78.5 67,78.5 74,85.5 94,85.5 111,68.5 111,61.5 115,57.5 138,57.5 140.5,60 150,60 168,78 168,84.5 160.25,92.25 160.25,102.25 161,103 171.5,103 173.81,100.69 R13.1
L_CAMERA_1
  Top 0.254: IC1.15 16,83.16 16,91 14.81,92.19 R2.1
L_CAMERA_2
  Bottom 0.254: IC1.1 12.8,75.5 6,75.5 4.5,77 4.5,85.5 6,87 30,87 32.31,89.31 R3.1
L_CAMERA_3
  Bottom 0.254: IC1.2 15.5,75.34 15.5,79 16.5,80 33,80 34.5,81.5 34.5,92 37.5,95 48,95 49.81,93.19 R5.1
L_CAMERA_4
  Bottom 0.254: IC1.3 18.5,75.5 18.5,78.5 19,79 33.5,79 36,81.5 36,88.5 38,90.5 66,90.5 67.31,91.81 R6.1
L_PRESET_1
  Top 0.254: IC1.4 20.5,74.96 20.5,69 20,68.5 20,52.69 R7.1
L_PRESET_2
  Top 0.254: R8.1 32.31,58.19 23.27,67.23 IC1.5
L_PRESET_3
  Top 0.254: R9.1 49,48.31 49,56.5 38,67.5 28,67.5 25.81,69.69 IC1.6
L_PRESET_4
  Top 0.254: IC1.7 28.35,70.65 30.5,68.5 52.5,68.5 54.5,66.5 54.5,46.5 56,45 67,45 67.5,45.5 67.5,47.31 R10.1
L_PRESET_5
  Bottom 0.254: IC2.15 50.5,82.66 50.5,80 48.5,78 46.5,78 45.5,77 45.5,72.5 47.5,70.5 87,70.5 89.5,68 89.5,50 87,47.5 R11.1
L_PRESET_6
  Bottom 0.254: IC2.1 48,75.08 48,72.5 49,71.5 87.5,71.5 102,57 102,47.81 R12.1
LEFT
  Top 0.254: IC5.13 133.73,27.81 RN3.4
  Bottom 0.254: LEFT.1 159.75,25 134.5,25 133.73,25.77 133.73,27.81 RN3.4
N$1
  Top 0.254: IC1.9 31,82.92 31,85.5 32,86.5 52.5,86.5 53.19,85.81 IC2.14
N$2  (via drill 0.6)
  Top 0.254: R14.1 148.5,54 151.5,57 151.5,74 v148.5,77
  Bottom 0.254: v148.5,77 143,77 141.5,75.5 141.5,71.96 IC3.10 | IC4.9 R14.1
N$3
  Top 0.254: R2.2 CAMERA_1.L+
N$4  (via drill 0.6)
  Top 0.254: R15.1 148.5,22.5 150,24 150,48.5 v151,49.5
  Bottom 0.254: IC5.9 R15.1 | v151,49.5 150.5,49 150.5,45.5 149,44 142,44 141.35,44.65 IC4.10
N$5
  Top 0.254: R8.2 PRESET_2.L+
N$6
  Bottom 0.61: X1.1 21.58,122.92 18,126.5 18,138.28 X2.1
N$7
  Bottom 0.61: X1.2 26.5,128 23,131.5 X2.2
N$8
  Bottom 0.61: X1.3 29.42,133.08 28,134.5 28,138.28 X2.3
N$11
  Top 0.254: R3.2 CAMERA_2.L+
N$12
  Top 0.254: R5.2 CAMERA_3.L+
N$13
  Top 0.254: R9.2 PRESET_3.L+
N$14
  Top 0.254: R6.2 CAMERA_4.L+
N$17
  Top 0.254: R13.2 FOCUS_AF.L+
N$21
  Top 0.254: R10.2 PRESET_4.L+
N$22
  Top 0.254: R7.2 PRESET_1.L+
N$25
  Top 0.254: R11.2 PRESET_5.L+
N$28
  Top 0.254: R12.2 PRESET:6.L+
PRESET_1  (via drill 0.6)
  Top 0.254: v116,68.5 v83.5,68.5
  Bottom 0.254: RN1.6 128.5,79.96 128.5,75.5 127.5,74.5 116.5,74.5 116,74 v116,68.5 115,67.5 115,63.5 117,61.5 131,61.5 131.19,61.69 IC3.3 | PRESET_1.1 7.5,58.25 7.5,65.5 11.5,69.5 82.5,69.5 v83.5,68.5
PRESET_2  (via drill 0.6)
  Top 0.254: v116.5,76 116,75.5 116,71 115,70 82.5,70 80.5,68 v80.5,67
  Bottom 0.254: RN1.7 126,79.92 126,77 125,76 v116.5,76 114.5,76 114,75.5 114,63 116.5,60.5 133,60.5 133.73,61.23 IC3.4 | PRESET_2.1 27,60.25 27,67 28.5,68.5 79,68.5 v80.5,67
PRESET_3  (via drill 0.6)
  Top 0.254: v77,67 77,68.5 80,71.5 112.5,71.5 113,72 113,76.5 v114,77.5
  Bottom 0.254: RN1.8 123.5,79.88 123.5,78 123,77.5 v114,77.5 113,76.5 113,62.5 116,59.5 135.5,59.5 136.27,60.27 IC3.5 | PRESET_3.1 44.5,60.25 44.5,66.5 45.5,67.5 76.5,67.5 v77,67
PRESET_4  (via drill 0.6)
  Top 0.254: v112,79 112,73.5 111.5,73 78.5,73 72,66.5 v72,65
  Bottom 0.254: RN1.9 121,79.84 120.16,79 v112,79 112,62 115.5,58.5 137.5,58.5 138.81,59.81 IC3.6 | PRESET_4.1 62.5,60.75 62.5,65 64,66.5 70,66.5 71.5,65 v72,65
PRESET_5  (via drill 0.6)
  Top 0.254: IC4.11 138.81,54.81 RN2.2 | RN2.2 138.5,55.12 | v113,55 116.5,58.5 136.5,58.5 138.62,56.38 RN2.2
  Bottom 0.254: v113,55 114.5,56.5 118.5,56.5 119,56 119,53.5 118.5,53 116.5,53 112.5,49 112.5,43 111,41.5 88.5,41.5 80.5,49.5 75,49.5 74,50.5 74,55 74.5,55.5 PRESET_5.1
PRESET_6  (via drill 0.6)
  Top 0.254: IC4.12 136.27,54.81 RN2.3 136,55.08 136,56.5 135,57.5 119.5,57.5 v117,55
  Bottom 0.254: PRESET:6.1 92,55.25 92,44 93.5,42.5 110.5,42.5 111.5,43.5 111.5,49.5 v117,55
RIGHT
  Top 0.254: IC5.14 131.19,27.81 RN3.5
  Bottom 0.254: RIGHT.1 193.75,24 134,24 131.19,26.81 131.19,27.81 RN3.5
RX
  Top 0.254: 121.13,137 U1.P$2 118.86,136.86 110,128 110,121.5 108,119.5 86.5,119.5 84.5,121.5 84.5,127.5 86.27,129.27 JP1.3
  Top 0.406: U1.2 U1.P$2
SCK  (via drill 0.6)
  Top 0.254: IC1.11 25.5,83.12 25.5,86.5 26.5,87.5 55.5,87.5 v56.5,86.5 | v82,106.5 81,105.5 81,92 v78,89 | 109,38 108,37 108,18 116.5,9.5 127,9.5 128.65,11.15 IC5.2 | 109,38 111,40 123.5,40 125,41.5 128,41.5 128.5,41 128.5,39.34 IC4.2 | IC3.2 128.5,64.04 128.5,61.5 127.5,60.5 111,60.5 109,58.5 109,38
  Top 0.406: U1.9 U1.P$9
  Bottom 0.254: v56.5,86.5 60,86.5 60.81,85.69 | 60.81,85.69 IC2.11 | 60.81,85.69 60.81,85.81 61.5,86.5 75.5,86.5 v78,89 | v82,106.5 82,112.5 86.5,117 112.5,117 114.5,119 122.3,119 U1.9 130.42,119.08 133,116.5 133,93.5 137.5,89 162,89 167,84 167,78.5 155,66.5 129,66.5 128.5,66 128.5,64.34 IC3.2
SH  (via drill 0.6)
  Top 0.254: IC1.12 23.5,83.04 23.5,87.5 24.5,88.5 58,88.5 | 58,88.5 72.5,88.5 78,94 78,109.5 81.5,113 111.5,113 v112.5,112 | IC2.12 58.27,88.23 58,88.5 | IC5.1 126,13.08 126,11 125.5,10.5 117,10.5 109,18.5 109,34 v110,35 110,36.5 112.5,39 125.92,39 IC4.1 | IC3.1 126,64.08 126,62 125.5,61.5 110.5,61.5 108,59 108,40.5 107.5,40 v107.5,39.5
  Top 0.406: U1.10 U1.P$10
  Bottom 0.254: v112.5,112 112.5,115 114,116.5 122.34,116.5 U1.10 129.96,116.54 132,114.5 132,93 137,88 161.5,88 166,83.5 166,79 154.5,67.5 127,67.5 126,66.5 126,64.3 IC3.1 | v107.5,39.5 110,37 v110,35
SI
  Top 0.406: U1.12 U1.P$12
  Bottom 0.254: R1.2 IC3.9 143.89,73.89 145,75 149.5,75 150,75.5 150,78 141.5,86.5 132.5,86.5 129.5,89.5 129.5,109.5 127.54,111.46 U1.12
SO
  Top 0.254: IC1.14 18,83 18,87.5 20,89.5 72,89.5 77,94.5 77,110 81,114 U1.P$11
  Top 0.406: U1.11 U1.P$11
SPEED_PTZ
  Top 0.254: U1.31 140.2,116.5 141.23,116.5 U1.P$31 141.31,116.5 152,116.5 154,114.5 154,97 143.25,86.25 77.75,86.25 69,77.5 69,71 64,66 64,58 69.5,52.5 69.5,23.5 68,22 29.5,22 28.5,23 SPEED_PTZ.2
SPEED_ZOOM
  Top 0.254: U1.32 140.24,119 141.19,119 | 141.19,119 152,119 155.5,115.5 155.5,96.5 144,85 78,85 70,77 70,65 72,63 72,53.5 70.5,52 70.5,31 72.5,29 80,29 81,28 SPEED_ZOOM.2 | 141.19,119 U1.P$32
TX
  Top 0.254: 121.17,139.5 U1.P$1 119.9,139.4 109.5,129 101,129 99.69,127.69 R4.1 99.46,126.73 JP1.2
  Top 0.406: U1.1 U1.P$1
UP_CENTER
  Top 0.254: IC5.11 138.81,27.81 RN3.2
  Bottom 0.254: UP_CENTER.1 181,46.25 181,41 180,40 163,40 154,31 139.5,31 138.62,30.12 RN3.2
UP_LEFT
  Bottom 0.254: RN2.9 121,54.84 121,52.5 120.5,52 117,52 114,49 114,36 116.5,33.5 138,33.5 138.81,34.31 IC4.6 138.81,41.31 139.5,42 150,42 154.5,46.5 UP_LEFT.1
UP_RIGHT
  Top 0.254: IC5.12 136.27,27.81 RN3.3
  Bottom 0.254: UP_RIGHT.1 198.75,47.25 197,49 180,49 179,48 179,42.5 177.5,41 162.5,41 153.5,32 137.5,32 136.08,30.58 RN3.3
VBUS
  Top 0.406: U1.P$40 U1.40
ZOOM_T
  Bottom 0.254: RN2.8 123.5,54.88 123.5,51.5 123,51 117.5,51 115,48.5 115,36.5 117,34.5 135.5,34.5 136.27,35.27 IC4.5 136.27,41.77 137.5,43 149.5,43 159,52.5 159,57.5 161.5,60 195,60 198.75,63.75 ZOOM_T.1
ZOOM_W  (via drill 0.6)
  Top 0.254: v128.5,50.5 125.92,53.08 RN2.7
  Bottom 0.254: IC4.4 133.73,36.23 133,35.5 117.5,35.5 116,37 116,48 118,50 124.5,50 125,50.5 125,52.5 126,53.5 126,55 RN2.7 | v128.5,50.5 129.5,49.5 145.5,49.5 169.5,73.5 ZOOM_W.1

### Text on the board
Top: A+ | B- | PTZ_CTRL_V23 | VMConnection design | MADE IN ITALY
tNames: P_1